# EAGLE design board (EAGLE 8.2.0)
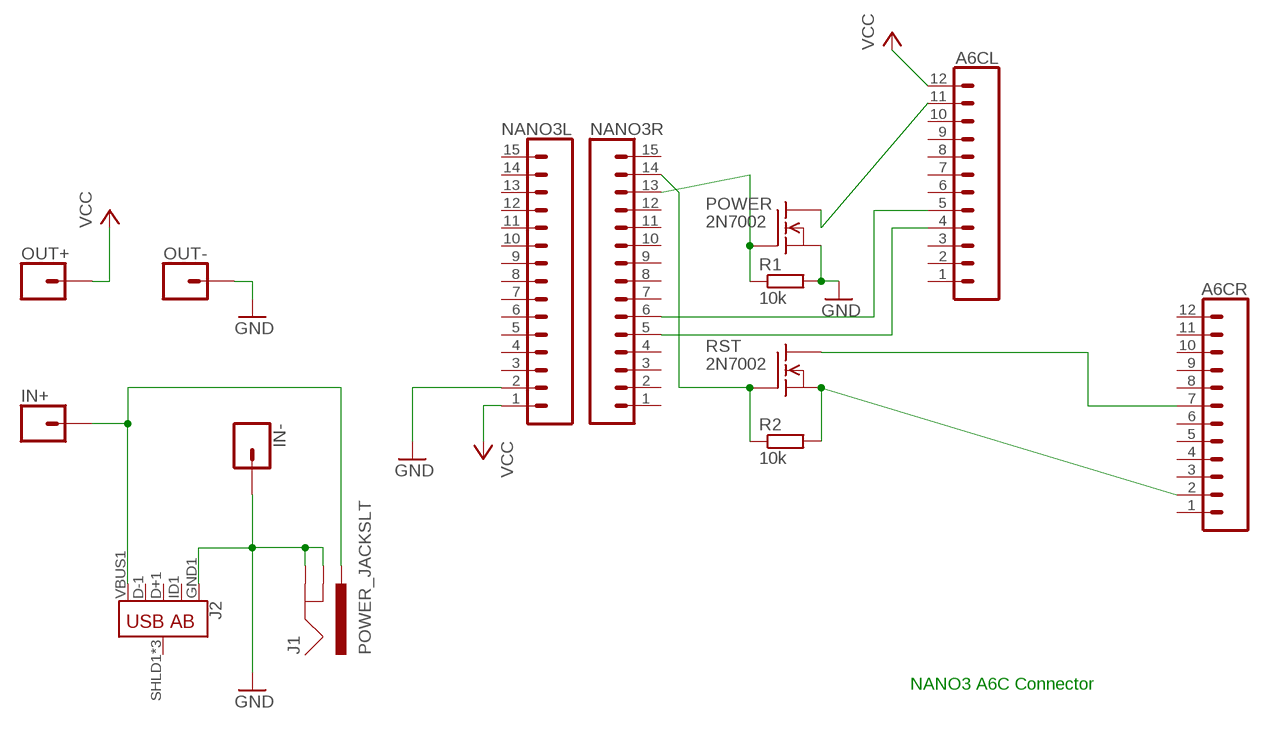
[diagram p0: schematic, sheet 1]

## Parts
A6CL  CONN_12  [1X12]
A6CR  CONN_12  [1X12]
IN+  CONN_01  [1X01]
IN-  CONN_01  [1X01]
J1  POWER_JACKSLT  [POWER_JACK_SLOT]
J2  USB_AB_SMT  [USB-AB-MICRO-SMD]
NANO3L  CONN_15  [1X15]
NANO3R  CONN_15  [1X15]
OUT+  CONN_01  [1X01]
OUT-  CONN_01  [1X01]
POWER  2N7002  [SOT23]
R1  10k  R-EU_R0402  [R0402]
R2  10k  R-EU_R0402  [R0402]
RST  2N7002  [SOT23]

## Nets
GND: IN-.1 J1.GND@1(GNDBREAK) J1.GND@2(GND) J2.GND1(GND) NANO3L.2 OUT-.1 POWER.2(S) R1.2
N$1: IN+.1 J1.PWR J2.VBUS1(VBUS)
N$2: A6CR.7 RST.3(D)
N$5: NANO3R.13 POWER.1(G) R1.1
N$7: NANO3R.14 R2.1 RST.1(G)
N$8: A6CR.2 R2.2 RST.2(S)
N$10: A6CL.11 POWER.3(D)
N$12: A6CL.4 NANO3R.5
N$13: A6CL.5 NANO3R.6
VCC: A6CL.12 NANO3L.1 OUT+.1
Unconnected: A6CL.1 A6CL.2 A6CL.3 A6CL.6 A6CL.7 A6CL.8 A6CL.9 A6CL.10 A6CR.1 A6CR.3 A6CR.4 A6CR.5 A6CR.6 A6CR.8 A6CR.9 A6CR.10 A6CR.11 A6CR.12 J2.D+1(D+) J2.D-1(D-) J2.ID1(USBID) J2.SHLD1(SHIELD) J2.SHLD2(SHIELD) J2.SHLD3(SHIELD) NANO3L.3 NANO3L.4 NANO3L.5 NANO3L.6 NANO3L.7 NANO3L.8 NANO3L.9 NANO3L.10 NANO3L.11 NANO3L.12 NANO3L.13 NANO3L.14 NANO3L.15 NANO3R.1 NANO3R.2 NANO3R.3 NANO3R.4 NANO3R.7 NANO3R.8 NANO3R.9 NANO3R.10 NANO3R.11 NANO3R.12 NANO3R.15

## Notes on the sheet
- NANO3 A6C Connector

## Library data of the parts
A6CL A6CR = SparkFun-Connectors:CONN_12: Multi connection point. Often used as Generic Header-pin footprint for 0.1 inch spaced/style header connections On any of the 0.1 inch spaced packages, you can populate with these: Break Away Headers - Straight <https://www.sparkfun.com/products/116> (PRT-00116) Break Away Male Headers - Right Angle <https://www.sparkfun.com/products/553> (PRT-00553) Female Headers <https://www.sparkfun.com/products/115> (PRT-00115) Break Away Headers - Machine Pin <https://www.sparkfun.com/products/117> (PRT-00117) Break Away Female Headers - Swiss Machine Pin <https://www.sparkfun.com/products/743> (PRT-00743) For SCREWTERMINALS and SPRING TERMINALS visit here: Screw Terimnals on SparkFun.com <https://www.sparkfun.com/search/results?term=Screw+Terminals> (5mm/3.5mm/2.54mm spacing) This device is also useful as a general connection point to wire up your design to another part of your project. Our various solder wires solder well into these plated through hole pads. Hook-Up Wire - Assortment (Stranded, 22 AWG) <https://www.sparkfun.com/products/11375> (PRT-11375) Hook-Up Wire - Assortment (Solid Core, 22 AWG) <https://www.sparkfun.com/products/11367> (PRT-11367) View the entire wire category on our website here <https://www.sparkfun.com/categories/141> Special notes: Molex polarized connector foot print use with SKU : PRT-08231 with associated crimp pins and housings. 1MM SMD Version SKU: PRT-10208 NOTES ON THE VARIANTS LOCK and LOCK_LONGPADS... This footprint was designed to help hold the alignment of a through-hole component (i.e. 6-pin header) while soldering it into place. You may notice that each hole has been shifted either up or down by 0.005 of an inch from it's more standard position (which is a perfectly straight line). This slight alteration caused the pins (the squares in the middle) to touch the edges of the holes. Because they are alternating, it causes a "brace" to hold the component in place. 0.005 has proven to be the perfect amount of "off-center" position when using our standard breakaway headers. Although looks a little odd when you look at the bare footprint, once you have a header in there, the alteration is very hard to notice. Also,if you push a header all the way into place, it is covered up entirely on the bottom side.
IN+ IN- OUT+ OUT- = SparkFun-Connectors:CONN_01: Single connection point. Often used as Generic Header-pin footprint for 0.1 inch spaced/style header connections On any of the 0.1 inch spaced packages, you can populate with these: Break Away Headers - Straight <https://www.sparkfun.com/products/116> (PRT-00116) Break Away Male Headers - Right Angle <https://www.sparkfun.com/products/553> (PRT-00553) Female Headers <https://www.sparkfun.com/products/115> (PRT-00115) Break Away Headers - Machine Pin <https://www.sparkfun.com/products/117> (PRT-00117) Break Away Female Headers - Swiss Machine Pin <https://www.sparkfun.com/products/743> (PRT-00743) This device is also useful as a general connection point to wire up your design to another part of your project. Our various solder wires solder well into these plated through hole pads. Hook-Up Wire - Assortment (Stranded, 22 AWG) <https://www.sparkfun.com/products/11375> (PRT-11375) Hook-Up Wire - Assortment (Solid Core, 22 AWG) <https://www.sparkfun.com/products/11367> (PRT-11367) View the entire wire category on our website here <https://www.sparkfun.com/categories/141> Special notes: SMTSO-256-ET is a "flush mount" nut for a 4-40 screw. We mostly use this on specialty testbeds; it is a nice way to connect hardware to your PCB at an adjustable hieght. Also note, the SNAP packages are for using a snappable style connector. We sell a baggie of snaps and they are also used on two LilyPad designs: Snap Assortment - 30 pack (male and female) <https://www.sparkfun.com/products/11347> (DEV-11347) LilyPad Arduino SimpleSnap <https://www.sparkfun.com/products/10941> (DEV-10941) LilyPad SimpleSnap Protoboard <https://www.sparkfun.com/products/10940> (DEV-10940)
J1 = SparkFun-Connectors:POWER_JACK: Power Jack Connector This is the standard 5.5mm barrel jack for power. The PTH is the most common, proven, reliable, footprint. The Slot footprint only works if the mill layer is transmitted to the PCB fab house so be warned. Here are the connectors we sell at SparkFun: DC Barrel Power Jack/Connector <https://www.sparkfun.com/products/119> (PRT-00119) DC Barrel Power Jack/Connector (SMD) <https://www.sparkfun.com/products/12748> (PRT-12748) DC Barrel Jack Adapter - Breadboard Compatible <https://www.sparkfun.com/products/10811> (PRT-10811) It is used on this SparkFun product (and many, many others): SparkFun RedBoard - Programmed with Arduino <https://www.sparkfun.com/products/12757> (DEV-12757) Also, if you need a mating power supply or connector, please check these out: Wall Adapter Power Supply - 9VDC 650mA <https://www.sparkfun.com/products/298> (TOL-00298) DC Barrel Jack Adapter - Male <https://www.sparkfun.com/products/10287> (PRT-10287); PROD_ID: PRT-00119
J2 = SparkFun-Connectors:USB_AB: USB Type AB Micro Connector OTG-compatible. 5 pins, 3 shield pins SparkFun Products: IOIO-OTG <https://www.sparkfun.com/products/13613> SparkFun SAMD21 Mini Breakout <https://www.sparkfun.com/products/13664>; PROD_ID: CONN-11794
NANO3L NANO3R = SparkFun-Connectors:CONN_15: Multi connection point. Often used as Generic Header-pin footprint for 0.1 inch spaced/style header connections On any of the 0.1 inch spaced packages, you can populate with these: Break Away Headers - Straight <https://www.sparkfun.com/products/116> (PRT-00116) Break Away Male Headers - Right Angle <https://www.sparkfun.com/products/553> (PRT-00553) Female Headers <https://www.sparkfun.com/products/115> (PRT-00115) Break Away Headers - Machine Pin <https://www.sparkfun.com/products/117> (PRT-00117) Break Away Female Headers - Swiss Machine Pin <https://www.sparkfun.com/products/743> (PRT-00743) For SCREWTERMINALS and SPRING TERMINALS visit here: Screw Terimnals on SparkFun.com <https://www.sparkfun.com/search/results?term=Screw+Terminals> (5mm/3.5mm/2.54mm spacing) This device is also useful as a general connection point to wire up your design to another part of your project. Our various solder wires solder well into these plated through hole pads. Hook-Up Wire - Assortment (Stranded, 22 AWG) <https://www.sparkfun.com/products/11375> (PRT-11375) Hook-Up Wire - Assortment (Solid Core, 22 AWG) <https://www.sparkfun.com/products/11367> (PRT-11367) View the entire wire category on our website here <https://www.sparkfun.com/categories/141> Special notes: Molex polarized connector foot print use with SKU : PRT-08231 with associated crimp pins and housings. 1MM SMD Version SKU: PRT-10208 NOTES ON THE VARIANTS LOCK and LOCK_LONGPADS... This footprint was designed to help hold the alignment of a through-hole component (i.e. 6-pin header) while soldering it into place. You may notice that each hole has been shifted either up or down by 0.005 of an inch from it's more standard position (which is a perfectly straight line). This slight alteration caused the pins (the squares in the middle) to touch the edges of the holes. Because they are alternating, it causes a "brace" to hold the component in place. 0.005 has proven to be the perfect amount of "off-center" position when using our standard breakaway headers. Although looks a little odd when you look at the bare footprint, once you have a header in there, the alteration is very hard to notice. Also,if you push a header all the way into place, it is covered up entirely on the bottom side.
POWER RST = transistors_gaui:2N7002
R1 R2 = rcl:R-EU_: RESISTOR, European symbol

## Net classes
0 default: clearance 0.254 mm

## Board
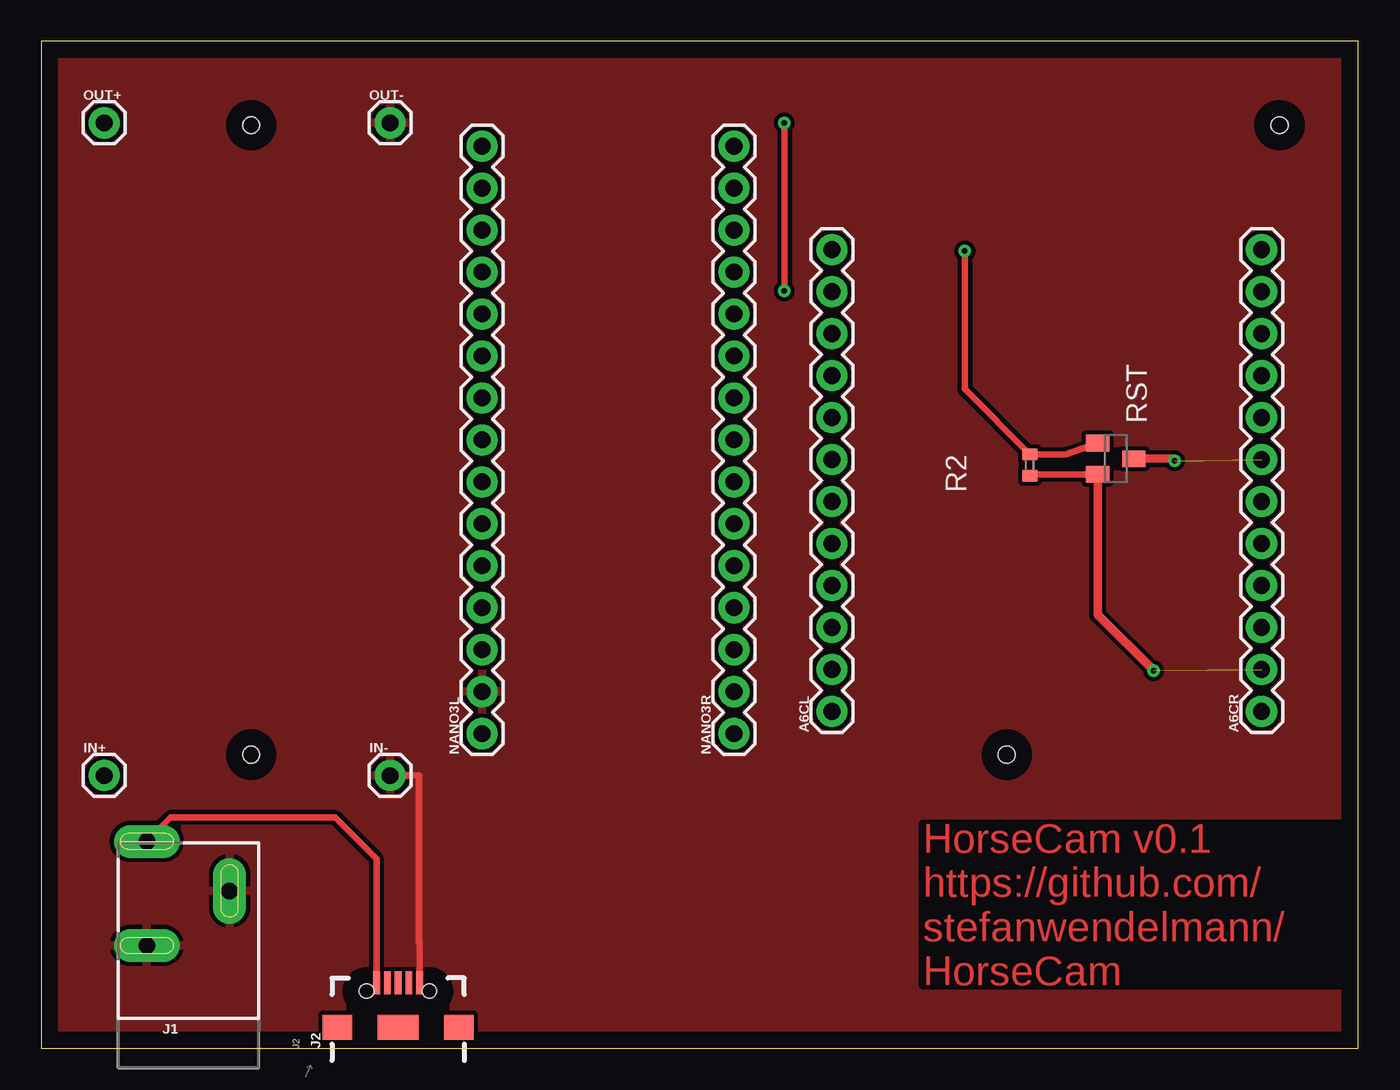
[diagram p1: board, top side]
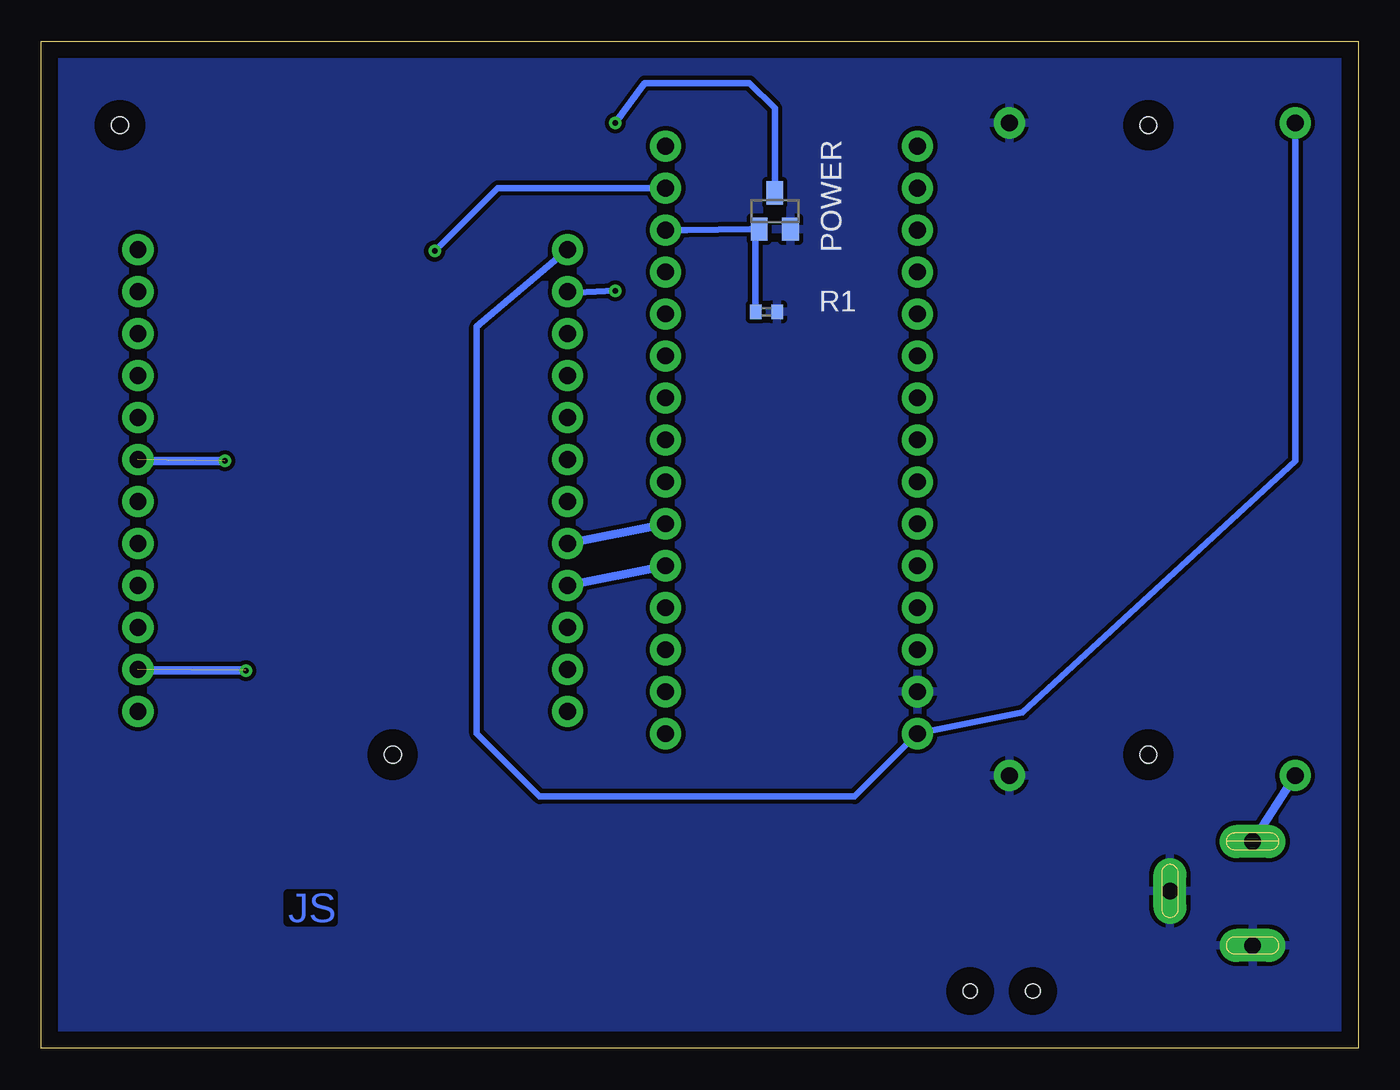
[diagram p2: board, bottom side, seen from below]

Size 79.68 x 60.95 mm. Coordinates in mm from the lower left corner, seen from the top.
Outline: 0,0 79.68,0 79.68,60.95 0,60.95 0,0
Copper layers (1*16): Top 0.035mm / dielectric 1.5mm / Bottom 0.035mm
Design rules "default": minimum track width 6mil, minimum drill 0.35mm, track to track 6mil, track to pad 6mil, pad to pad 6mil, via to via 6mil, smd to smd 6mil, copper to edge 40mil, drill to drill 6mil, minimum pad ring 10mil, minimum via ring 8mil, stop-mask expansion 4mil, vias tented up to drill 0mil, thermal gap 10mil
Holes 1 mm at 74.93,55.88 12.7,55.88 12.7,17.78 58.42,17.78

### Footprints (pad centres in the part's own frame; a part is rotated, then mirrored left to right if it is on the bottom)
1X12 = drill 1.016 pad 1.88: 1 0,0; 2 2.54,0; 3 5.08,0; 4 7.62,0; 5 10.16,0; 6 12.7,0; 7 15.24,0; 8 17.78,0; 9 20.32,0; 10 22.86,0; 11 25.4,0; 12 27.94,0
1X01 = drill 1.016 pad 1.88: 1 0,0
POWER_JACK_SLOT = drill 1 pad 2 long: GND@1 2.58,7.5; GND@2 7.58,10.8; PWR 2.58,13.8
USB-AB-MICRO-SMD = smd 1.4 x 0.4: D+1 2.7,0; D-1 2.7,0.65; GND1 2.7,-1.3; ID1 2.7,-0.65; VBUS1 2.7,1.3 | smd 1.5 x 1.8: SHLD1 0,-3.68; SHLD2 0,3.68 | smd 1.5 x 2.5: SHLD3 0,0 | hole 0.85: 2.2,1.9; 2.2,-1.9
1X15 = drill 1.016 pad 1.88: 1 0,0; 2 2.54,0; 3 5.08,0; 4 7.62,0; 5 10.16,0; 6 12.7,0; 7 15.24,0; 8 17.78,0; 9 20.32,0; 10 22.86,0; 11 25.4,0; 12 27.94,0; 13 30.48,0; 14 33.02,0; 15 35.56,0
SOT23 = smd 1 x 1.4: 1 -0.95,-1.1; 2 0.95,-1.1; 3 0,1.1
R0402 = smd 0.7 x 0.9: 1 -0.65,0; 2 0.65,0

### Placement (x,y rotation side)
A6CL  47.84,20.4 90 top
A6CR  73.84,20.4 90 top
IN+  3.81,16.51 0 top
IN-  21.11,16.51 0 top
J1  3.81,-1.27 0 top
J2  21.59,1.27 90 top
NANO3L  26.67,19.05 90 top
NANO3R  41.91,19.05 90 top
OUT+  3.81,56.01 0 top
OUT-  21.11,56.01 0 top
POWER  35.31,50.67 0 bottom
R1  35.81,44.58 0 bottom
R2  59.82,35.31 270 top
RST  65.02,35.69 270 top

### Tracks (layer width: path | path; a pad name or v marks a point on that pad's centre or on a via)
GND
  Top 0.406: J2.GND1 22.89,6.35 22.86,6.35 22.86,16.51 IN-.1
  pour Bottom: -20.32,19.05 -21.59,-13.97 109.22,-11.43 81.28,87.63 -29.21,80.01 -20.32,22.86
  pour Top: -41.91,59.69 -36.83,-33.02 149.86,-35.56 87.63,130.81 -44.45,114.3
N$1
  Top 0.406: J2.VBUS1 20.29,11.46 17.78,13.97 7.83,13.97 J1.PWR
  Bottom 0.508: J1.PWR IN+.1
N$2  (1 unrouted)
  Top 0.508: RST.3 68.45,35.69 68.58,35.56
N$4  (via drill 0.35)
  Bottom 0.508: v68.58,35.56 73.66,35.56
N$5
  Bottom 0.406: R1.1 36.46,49.37 POWER.1 36.79,49.57 40.64,49.53 NANO3R.13
N$6  (via drill 0.35)
  Bottom 0.508: v67.31,22.86 73.66,22.86
N$7  (via drill 0.35)
  Top 0.406: v55.88,48.26 55.88,39.89 R2.1 61.97,35.96 RST.1
  Bottom 0.406: NANO3R.14 52.07,52.07 v55.88,48.26
N$8  (1 unrouted)
  Top 0.406: RST.2 59.9,34.74 R2.2
  Top 0.508: RST.2 63.92,26.25 67.31,22.86
N$10  (via drill 0.35)
  Top 0.406: v44.96,56.01 v44.96,45.85
  Bottom 0.406: POWER.3 35.31,56.9 36.83,58.42 43.18,58.42 v44.96,56.01 | v44.96,45.85 47.88,45.72 47.92,45.72 A6CL.11
N$12
  Bottom 0.508: NANO3R.5 A6CL.4
N$13
  Bottom 0.508: NANO3R.6 A6CL.5
VCC
  Bottom 0.406: OUT+.1 3.81,35.56 20.32,20.32 NANO3L.1 30.48,15.24 49.53,15.24 53.34,19.05 53.34,43.67 A6CL.12

### Text on the board
Top: HorseCam v0.1 / https://github.com/ / stefanwendelmann/ / HorseCam
Bottom: JS